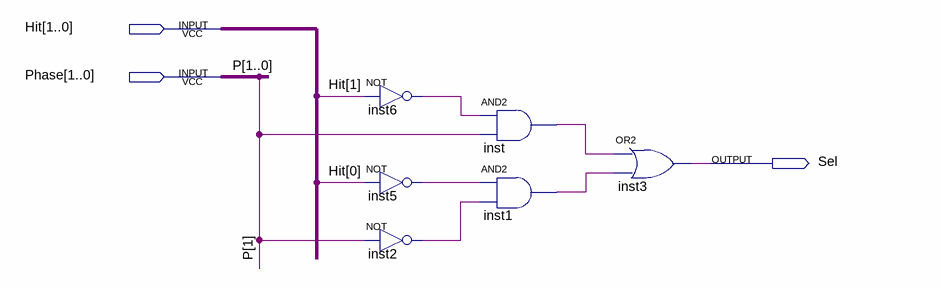
[diagram p0: schematic sheet]
// Quartus schematic SelectAddress.bdf as structural Verilog: 6 symbols, 3 pins
module SelectAddress (
  input  [1:0] Hit,
  input  [1:0] Phase,
  output Sel
);

  wire inst1_out, inst2_out, inst5_out, inst6_out, inst_out;

  not inst6 (inst6_out, Hit[1]);
  not inst5 (inst5_out, Hit[0]);
  not inst2 (inst2_out, Phase[1]);
  and inst (inst_out, inst6_out, Phase[1]);
  and inst1 (inst1_out, inst5_out, inst2_out);
  or inst3 (Sel, inst_out, inst1_out);

  // Other names for the same wires on the sheet: P[1:0] = Phase
endmodule
